# EAGLE schematic EV Circuit Diagram (EAGLE 9.7.0)
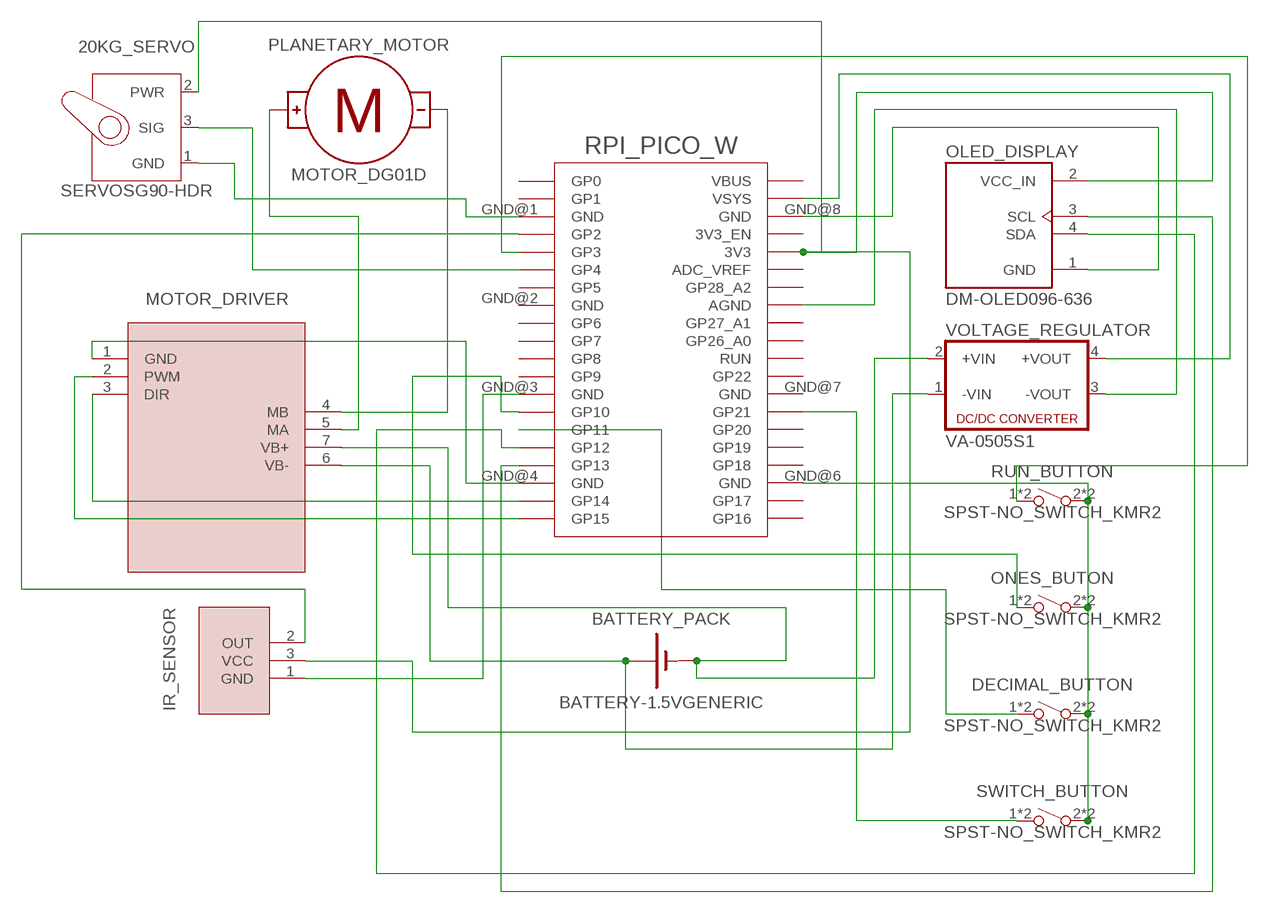
[diagram p0: schematic, sheet 1]

## Parts
20KG_SERVO  SERVOSG90-HDR  [1X03]
BATTERY_PACK  BATTERY-1.5VGENERIC  [BATTERY-GENERIC]
DECIMAL_BUTTON  SPST-NO_SWITCH_KMR2  [KMR2]
IR_SENSOR  IR_SENSOR  [IR_SENSOR]
MD20A_MOTOR_DRIVER  CYTRON_MD20A  [MD20A]
OLED_DISPLAY  DM-OLED096-636  [MODULE_DM-OLED096-636]
ONES_BUTON  SPST-NO_SWITCH_KMR2  [KMR2]
PLANETARY_MOTOR  MOTOR_DG01D  [DG01D]
RPI_PICO_W  RPI_PICO_IG-SMD  [RPI_PICO]
RUN_BUTTON  SPST-NO_SWITCH_KMR2  [KMR2]
SWITCH_BUTTON  SPST-NO_SWITCH_KMR2  [KMR2]
VOLTAGE_REGULATOR  VA-0505S1  [4SIL]

## Nets
N$1: MD20A_MOTOR_DRIVER.3(DIR) RPI_PICO_W.GP14
N$2: MD20A_MOTOR_DRIVER.2(PWM) RPI_PICO_W.GP15
N$3: MD20A_MOTOR_DRIVER.1(GND) RPI_PICO_W.GND@4(GND)
N$4: MD20A_MOTOR_DRIVER.4(MB) PLANETARY_MOTOR.-
N$5: MD20A_MOTOR_DRIVER.5(MA) PLANETARY_MOTOR.+
N$6: BATTERY_PACK.- MD20A_MOTOR_DRIVER.7(VB+) VOLTAGE_REGULATOR.2(+VIN)
N$7: RPI_PICO_W.VSYS VOLTAGE_REGULATOR.4(+VOUT)
N$8: IR_SENSOR.2(OUT) RPI_PICO_W.GP2
N$9: 20KG_SERVO.2(PWR) IR_SENSOR.3(VCC) OLED_DISPLAY.2(VCC_IN) RPI_PICO_W.3V3
N$10: IR_SENSOR.1(GND) RPI_PICO_W.GND@3(GND)
N$11: OLED_DISPLAY.3(SCL) RPI_PICO_W.GP13
N$12: OLED_DISPLAY.4(SDA) RPI_PICO_W.GP12
N$13: OLED_DISPLAY.1(GND) RPI_PICO_W.GND@8(GND)
N$14: BATTERY_PACK.+ MD20A_MOTOR_DRIVER.6(VB-) VOLTAGE_REGULATOR.1(-VIN)
N$15: RPI_PICO_W.AGND VOLTAGE_REGULATOR.3(-VOUT)
N$16: RPI_PICO_W.GP3 RUN_BUTTON.1 RUN_BUTTON.4
N$17: ONES_BUTON.1 ONES_BUTON.4 RPI_PICO_W.GP10
N$18: DECIMAL_BUTTON.1 DECIMAL_BUTTON.4 RPI_PICO_W.GP11
N$19: RPI_PICO_W.GP21 SWITCH_BUTTON.1 SWITCH_BUTTON.4
N$20: DECIMAL_BUTTON.2 DECIMAL_BUTTON.3 ONES_BUTON.2 ONES_BUTON.3 RPI_PICO_W.GND@6(GND) RUN_BUTTON.2 RUN_BUTTON.3 SWITCH_BUTTON.2 SWITCH_BUTTON.3
N$21: 20KG_SERVO.1(GND) RPI_PICO_W.GND@1(GND)
N$22: 20KG_SERVO.3(SIG) RPI_PICO_W.GP4
Unconnected: RPI_PICO_W.3V3_EN RPI_PICO_W.ADC_VREF RPI_PICO_W.GND@2(GND) RPI_PICO_W.GND@7(GND) RPI_PICO_W.GP0 RPI_PICO_W.GP1 RPI_PICO_W.GP5 RPI_PICO_W.GP6 RPI_PICO_W.GP7 RPI_PICO_W.GP8 RPI_PICO_W.GP9 RPI_PICO_W.GP16 RPI_PICO_W.GP17 RPI_PICO_W.GP18 RPI_PICO_W.GP19 RPI_PICO_W.GP20 RPI_PICO_W.GP22 RPI_PICO_W.GP26_A0 RPI_PICO_W.GP27_A1 RPI_PICO_W.GP28_A2 RPI_PICO_W.RUN RPI_PICO_W.VBUS

## Library data of the parts
20KG_SERVO = Tinkercad:SERVO
BATTERY_PACK = Tinkercad:BATTERY-1.5V
DECIMAL_BUTTON ONES_BUTON RUN_BUTTON SWITCH_BUTTON = Switch:SPST-NO_SWITCH: SPST Switches with NO Configuration; CATEGORY: Switches; DATASHEET: https://www.ckswitches.com/media/1479/kmr2.pdf; DESCRIPTION: Tactile Switch SPST-NO Top Actuated Surface Mount; MANUFACTURER: C&K; MPN: KMR211G LFS; OPERATING_TEMPERATURE: -40°C ~ 85°C; PACKAGE_SIZE: NA; PACKAGE_TYPE: Surface Mount; PART_STATUS: Active; ROHS: Compliant; SERIES: KMR2; SUBCATEGORY: Tactile Switches; TYPE: SPST-NO
IR_SENSOR = IR Sensor:IR_SENSOR
MD20A_MOTOR_DRIVER = MD20a:CYTRON_MD20A
OLED_DISPLAY = DM-OLED096-636:DM-OLED096-636: Check availability <https://pricing.snapeda.com/parts/DM-OLED096-636/Display%20Module/view-part?ref=eda>; AVAILABILITY: Not in stock; CHECK_PRICES: https://www.snapeda.com/parts/DM-OLED096-636/Display+Module/view-part/?ref=eda; DESCRIPTION: 0.96” 128 X 64 MONOCHROME GRAPHIC OLED DISPLAY MODULE - I2C; MF: Display Module; MP: DM-OLED096-636; PACKAGE: Package; PRICE: None; SNAPEDA_LINK: https://www.snapeda.com/parts/DM-OLED096-636/Display+Module/view-part/?ref=snap
PLANETARY_MOTOR = Tinkercad:MOTOR
RPI_PICO_W = RaspberryPi_Pico:RPI_PICO_IG
VOLTAGE_REGULATOR = dc-dc-converter:VA-*?: DC DC Converter Single Output, 1 Watt Motien Technology Co.,Ltd. Source: va-serie.pdf